# EAGLE design MotorDriver_Basic (EAGLE 9.3.2)
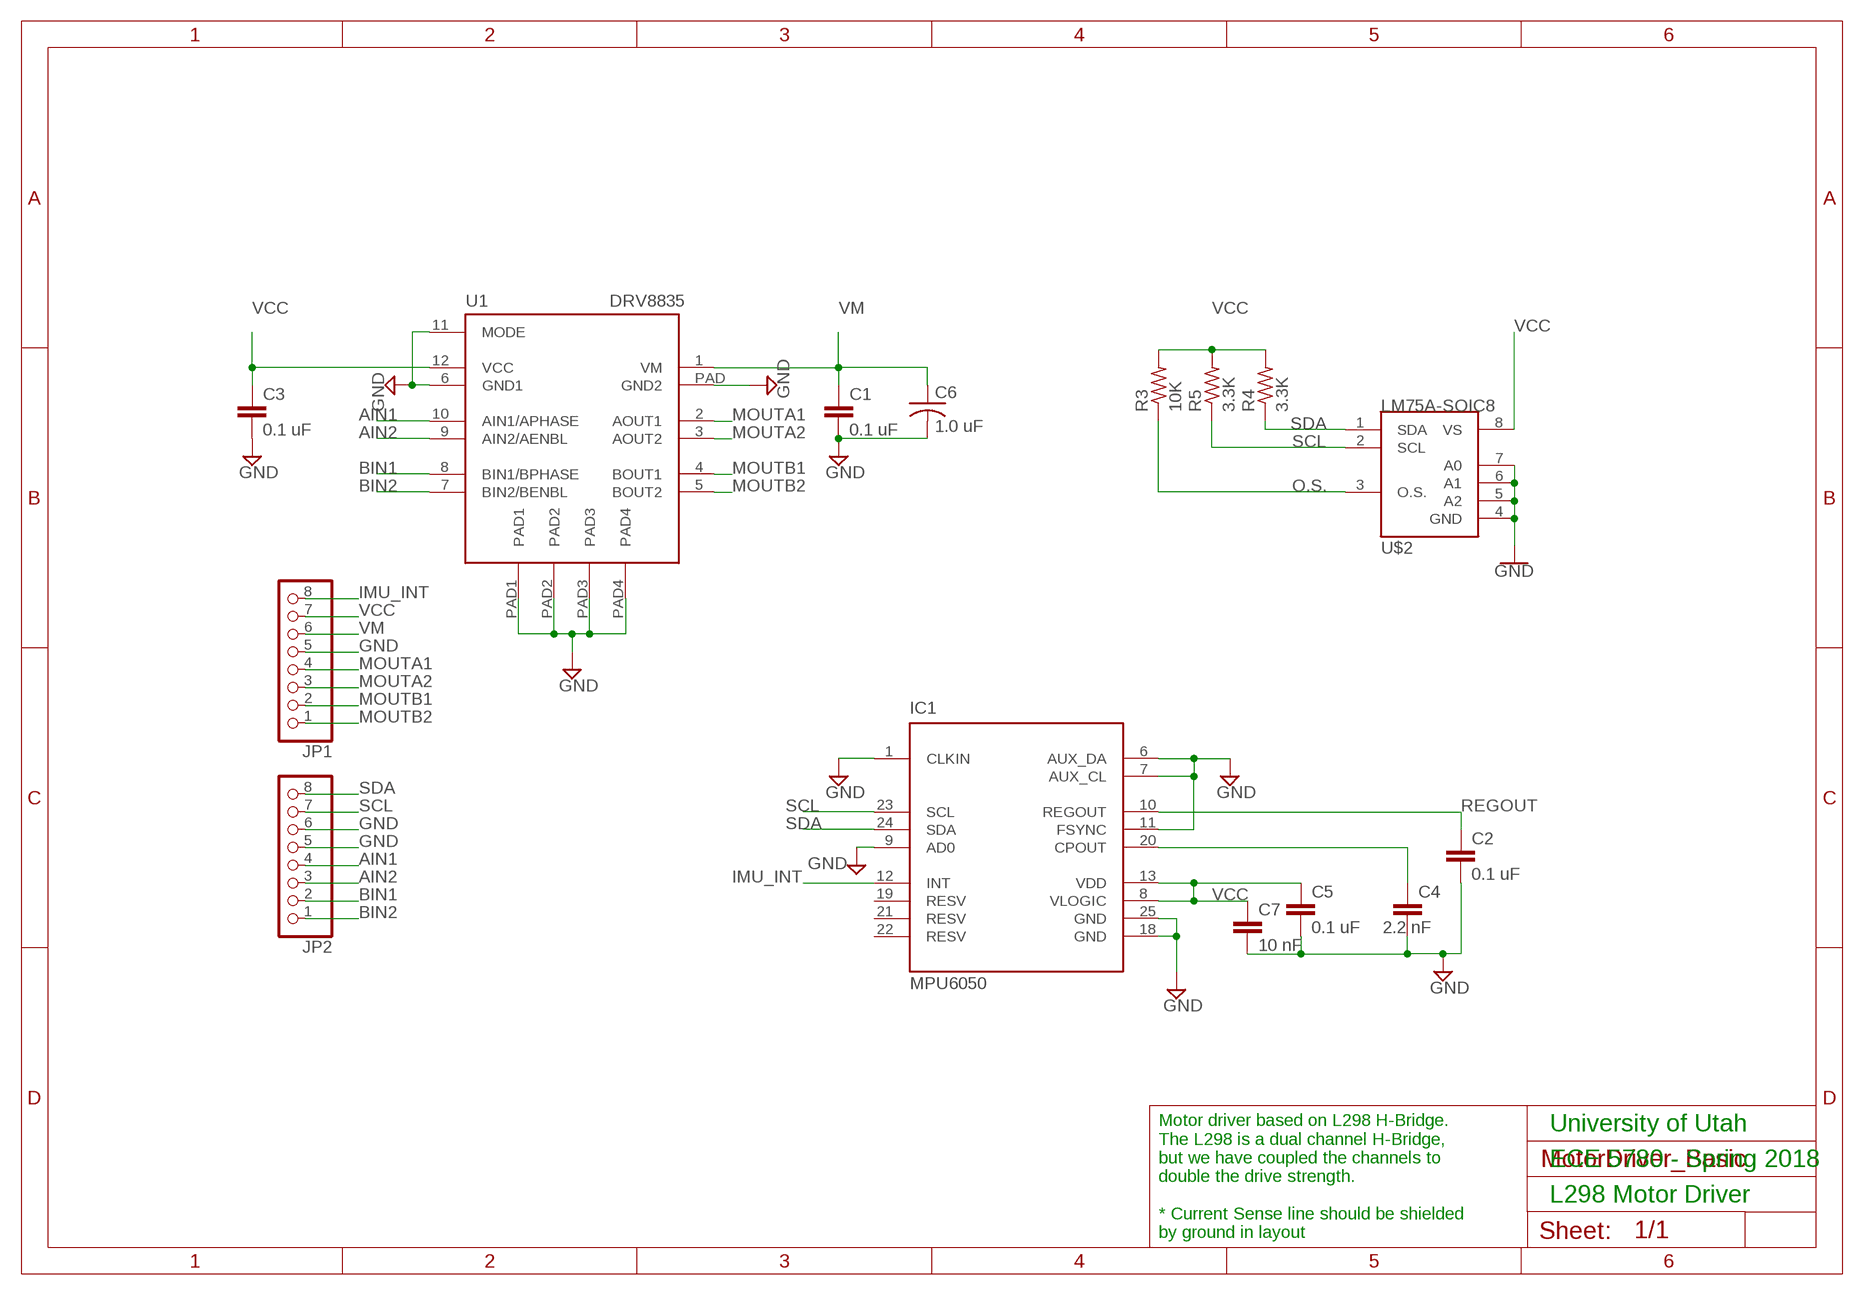
[diagram p0: schematic, sheet 1]

## Parts
C1  0.1 uF  C-EUC1206  [C1206]
C2  0.1 uF  C-EUC1206  [C1206]
C3  0.1 uF  C-EUC1206  [C1206]
C4  2.2 nF  C-EUC1206  [C1206]
C5  0.1 uF  C-EUC1206  [C1206]
C6  1.0 uF  C-US025-050X050  [C025-050X050]
C7  10 nF  C-EUC1206  [C1206]
IC1  MPU6050  [QFN50P400X400X95-25T265X275N]
JP1  PINHD-1X8  [1X08]
JP2  PINHD-1X8  [1X08]
R3  10K  R-US_M1206  [M1206]
R4  3.3K  R-US_M1206  [M1206]
R5  3.3K  R-US_M1206  [M1206]
U1  DRV8835  [WSON_2X3]
U$2  LM75A-SOIC8  [SOIC-8]

## Nets
AIN1: JP2.4 U1.10(AIN1/APHASE)
AIN2: JP2.3 U1.9(AIN2/AENBL)
BIN1: JP2.2 U1.8(BIN1/BPHASE)
BIN2: JP2.1 U1.7(BIN2/BENBL)
GND: C1.2 C2.2 C3.2 C4.2 C5.2 C6.2 C7.2 IC1.1(CLKIN) IC1.6(AUX_DA) IC1.7(AUX_CL) IC1.9(AD0) IC1.11(FSYNC) IC1.18(GND) IC1.25(GND) JP1.5 JP2.5 JP2.6 U1.6(GND1) U1.11(MODE) U1.PAD1 U1.PAD2 U1.PAD3 U1.PAD4 U1.PAD(GND2) U$2.4(GND) U$2.5(A2) U$2.6(A1) U$2.7(A0)
IMU_INT: IC1.12(INT) JP1.8
MOUTA1: JP1.4 U1.2(AOUT1)
MOUTA2: JP1.3 U1.3(AOUT2)
MOUTB1: JP1.2 U1.4(BOUT1)
MOUTB2: JP1.1 U1.5(BOUT2)
N$1: C4.1 IC1.20(CPOUT)
O.S.: R3.1 U$2.3(O.S.)
REGOUT: C2.1 IC1.10(REGOUT)
SCL: IC1.23(SCL) JP2.7 R5.1 U$2.2(SCL)
SDA: IC1.24(SDA) JP2.8 R4.1 U$2.1(SDA)
VCC: C3.1 C5.1 C7.1 IC1.8(VLOGIC) IC1.13(VDD) JP1.7 R3.2 R4.2 R5.2 U1.12(VCC) U$2.8(VS)
VM: C1.1 C6.1 JP1.6 U1.1(VM)
Unconnected: IC1.2(NC) IC1.3(NC) IC1.4(NC) IC1.5(NC) IC1.14(NC) IC1.15(NC) IC1.16(NC) IC1.17(NC) IC1.19(RESV) IC1.21(RESV) IC1.22(RESV)

## Notes on the sheet
- University of Utah
- ECE 5780 - Spring 2018
- L298 Motor Driver
- Motor driver based on L298 H-Bridge. 
  The L298 is a dual channel H-Bridge, 
  but we have coupled the channels to 
  double the drive strength. 
  
  * Current Sense line should be shielded 
  by ground in layout

## Library data of the parts
C1-C5 C7 = rcl:C-EU: CAPACITOR, European symbol; SPICEPREFIX: C
C6 = rcl:C-US: CAPACITOR, American symbol; SPICEPREFIX: C
IC1 = invensense:MPU6050: The triple-axis MEMS gyroscope
JP1 JP2 = pinhead:PINHD-1X8: PIN HEADER
R3-R5 = rcl:R-US_: RESISTOR, American symbol; SPICEPREFIX: R
U1 = bt_motordriver:DRV8835: DRV8835 DUAL LOW VOLTAGE H-BRIDGE IC The DRV8835 provides an integrated motor driver solution for cameras, consumer products, toys, and other low voltage or battery-powered motion control applications. The device has two H-bridge drivers, and can drive two DC motors or one stepper motor, as well as other devices like solenoids. The device has two H-bridge drivers, and drives two DC motors or one stepper motor, as well as other devices like solenoids. The output driver block for each consists of N-channel power MOSFETs configured as an H-bridge to drive the motor winding. An internal charge pump generates gate drive voltages. 1.5-A Maximum Drive Current Per H-Bridge Configure Bridges Parallel for 3-A Drive Curren 0-V to 11-V Motor-Operating Supply-Voltage 2-V to 7-V Logic Supply-Voltage Flexible PWM or PHASE/ENABLE Interface Low-Power Sleep Mode With 95-nA Maximum Supply Current Tiny 2.00-mm × 3.00-mm WSON Package Reference: http://www.ti.com/lit/ds/symlink/drv8835.pdf
U$2 = L298_Motor_Driver_Lib_ECE5780:LM75A-SOIC8

## Board
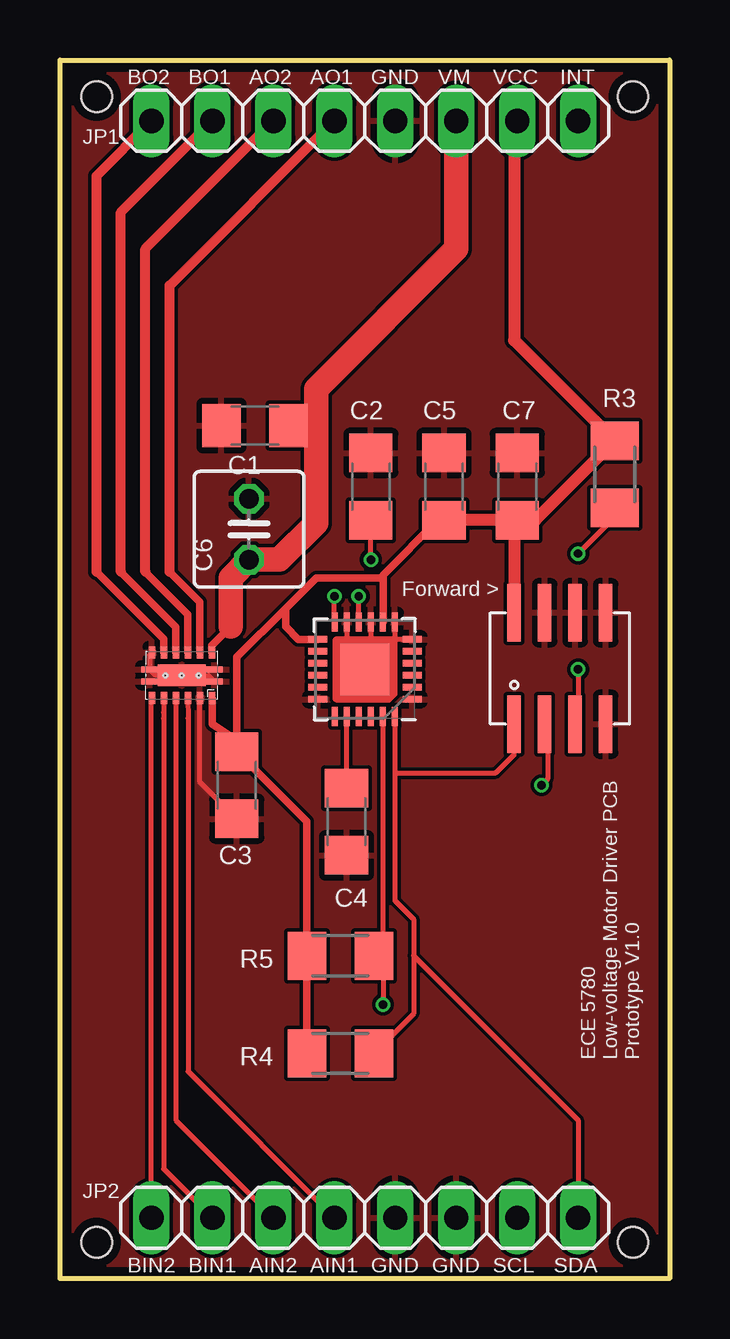
[diagram p1: board, top side]
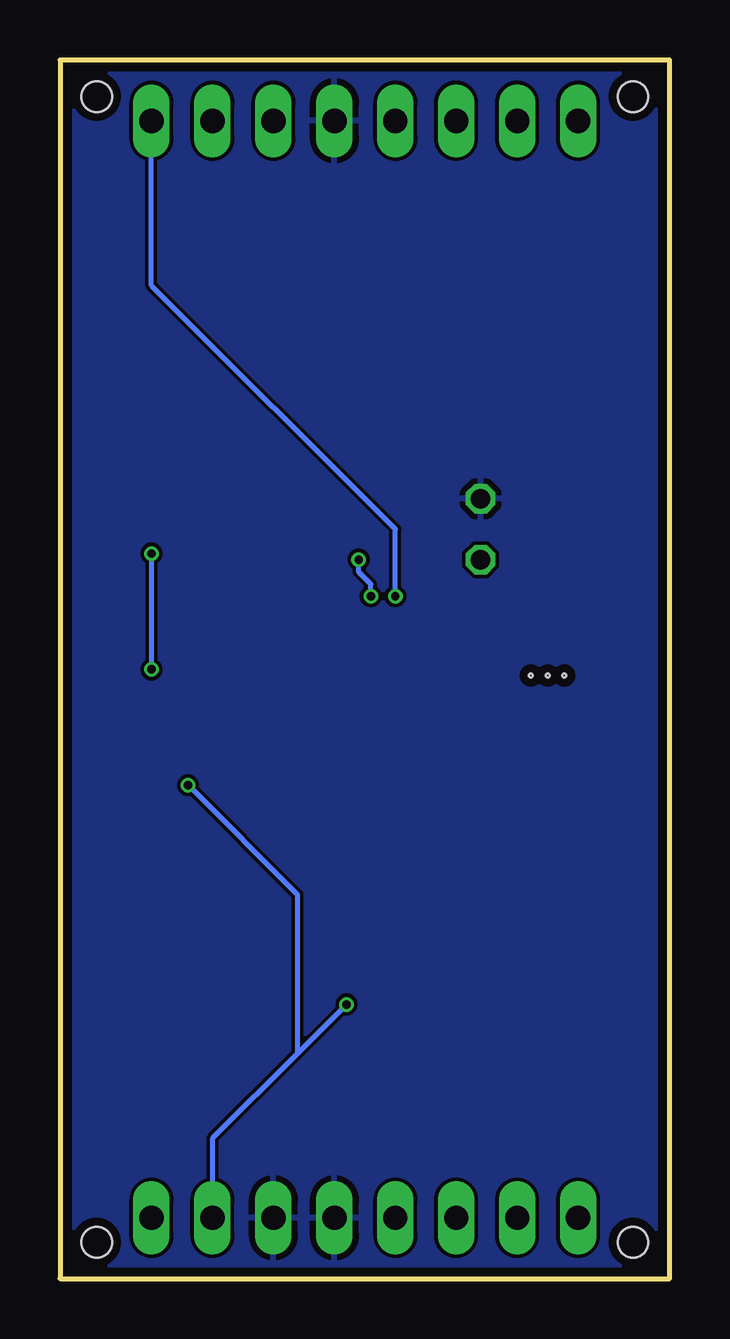
[diagram p2: board, bottom side, seen from below]

Size 25.4 x 50.8 mm. Coordinates in mm from the lower left corner, seen from the top.
Outline: 0,0 0,50.8 25.4,50.8 25.4,0 0,0
Copper layers (1*16): Top 0.035559375mm / dielectric 1.6mm / Bottom 0.035559375mm
Design rules "2layer": minimum track width 6mil, minimum drill 10mil, track to track 6mil, track to pad 6mil, pad to pad 6mil, via to via 6mil, smd to smd 6mil, copper to edge 15mil, drill to drill 6mil, minimum pad ring 5mil, minimum via ring 5mil, stop-mask expansion 2.5mil, vias tented up to drill 0mil, thermal gap 10mil
Holes 1.27 mm at 23.88,49.28 1.52,49.28 23.88,1.52 1.52,1.52

### Footprints (pad centres in the part's own frame; a part is rotated, then mirrored left to right if it is on the bottom)
C1206 = smd 1.6 x 1.8: 1 -1.4,0; 2 1.4,0
C025-050X050 = drill 0.813 octagon: 1 -1.27,0; 2 1.27,0
QFN50P400X400X95-25T265X275N = smd 0.26 x 0.79: 1 -1.25,-1.97; 2 -0.75,-1.97; 3 -0.25,-1.97; 4 0.25,-1.97; 5 0.75,-1.97; 6 1.25,-1.97; 13 1.25,1.97; 14 0.75,1.97; 15 0.25,1.97; 16 -0.25,1.97; 17 -0.75,1.97; 18 -1.25,1.97 | smd 0.79 x 0.26: 7 1.97,-1.25; 8 1.97,-0.75; 9 1.97,-0.25; 10 1.97,0.25; 11 1.97,0.75; 12 1.97,1.25; 19 -1.97,1.25; 20 -1.97,0.75; 21 -1.97,0.25; 22 -1.97,-0.25; 23 -1.97,-0.75; 24 -1.97,-1.25 | smd 2.15 x 2.05: 25 0,0
1X08 = drill 1.016 long: 1 -8.89,0; 2 -6.35,0; 3 -3.81,0; 4 -1.27,0; 5 1.27,0; 6 3.81,0; 7 6.35,0; 8 8.89,0
M1206 = smd 1.6 x 2: 1 -1.4,0; 2 1.4,0
WSON_2X3 = smd 0.28 x 0.5: 1 -1.25,-0.95; 2 -0.75,-0.95; 3 -0.25,-0.95; 4 0.25,-0.95; 5 0.75,-0.95; 6 1.25,-0.95; 7 1.25,0.95; 8 0.75,0.95; 9 0.25,0.95; 10 -0.25,0.95; 11 -0.75,0.95; 12 -1.25,0.95 | smd 2 x 0.9: PAD 0,0 | smd 0.7 x 0.25: PAD1 -1.35,0.25; PAD2 -1.35,-0.25; PAD3 1.35,-0.25; PAD4 1.35,0.25 | hole 0.15: 0,0; -0.7,0; 0.7,0
SOIC-8 = smd 2.388 x 0.559: 1 -2.54,1.905; 2 -2.54,0.635; 3 -2.54,-0.635; 4 -2.54,-1.905; 5 2.108,-1.905; 6 2.108,-0.635; 7 2.108,0.635; 8 2.108,1.905

### Placement (x,y rotation side)
C1  8.13,35.56 180 top
C2  12.95,33.02 90 top
C3  7.37,20.57 270 top
C4  11.94,19.05 270 top
C5  16,33.02 90 top
C6  7.87,31.24 90 top
C7  19.05,33.02 90 top
IC1  12.7,25.4 90 top
JP1  12.7,48.26 0 top
JP2  12.7,2.54 0 top
R3  23.11,33.53 90 top
R4  11.68,9.4 180 top
R5  11.68,13.46 180 top
U1  5.08,25.15 180 top
U$2  20.83,25.65 90 top

### Tracks (layer width: path | path; a pad name or v marks a point on that pad's centre or on a via)
AIN1
  Top 0.203: U1.10 5.33,23.37 5.33,8.64 JP2.4
AIN2
  Top 0.203: U1.9 4.83,23.37 4.83,6.6 JP2.3
BIN1
  Top 0.203: U1.8 4.32,23.62 4.32,23.37 4.32,4.57 JP2.2
BIN2
  Top 0.203: U1.7 3.81,24.18 JP2.1
GND
  Top 0.203: IC1.9 12.95,26.42 | 12.95,26.42 12.95,25.91 12.7,25.66 IC1.25 12.7,25.91 11.94,26.67 11.94,27.36 IC1.11 | IC1.6 13.95,26.65 IC1.7 13.95,26.73 13.63,26.42 12.95,26.42 | U1.6 3.73,26 U1.PAD3 3.98,25.15 U1.PAD 6.18,25.15 U1.PAD1 | U1.11 5.83,20.71 C3.2
  pour Top: 0,0 0,50.8 25.4,50.8 25.4,0
  pour Bottom: 0,0 0,50.8 25.4,50.8 25.4,0
IMU_INT  (via drill 0.35)
  Top 0.203: IC1.12 11.43,27.39 v11.43,28.45
  Bottom 0.203: v11.43,28.45 11.43,31.24 21.59,41.4 JP1.8
MOUTA1
  Top 0.305: U1.2 5.83,28.21 4.57,29.46
  Top 0.406: 4.57,29.46 4.57,41.4 JP1.4
MOUTA2
  Top 0.305: U1.3 5.33,27.69 3.56,29.46
  Top 0.406: 3.56,29.46 3.56,42.93 JP1.3
MOUTB1
  Top 0.305: U1.4 4.83,27.17 2.54,29.46
  Top 0.406: 2.54,29.46 2.54,44.45 JP1.2
MOUTB2
  Top 0.305: U1.5 4.33,26.66 1.52,29.46
  Top 0.406: 1.52,29.46 1.52,45.97 JP1.1
N$1
  Top 0.203: C4.1 11.95,20.46 IC1.20
O.S.  (via drill 0.35)
  Top 0.203: R3.1 23.11,31.75 v21.59,30.23 | v21.59,25.4 21.59,23.24 U$2.3
  Bottom 0.203: v21.59,30.23 v21.59,25.4
REGOUT  (via drill 0.35)
  Top 0.203: IC1.10 v12.45,28.45 | v12.95,29.97 C2.1
  Bottom 0.203: v12.45,28.45 12.45,28.96 12.95,29.46 v12.95,29.97
SCL  (via drill 0.35 pad 0.55)
  Top 0.203: IC1.23 13.45,13.83 R5.1 13.46,13.08 v13.46,11.43 | v20.07,20.57 20.32,20.83 20.32,22.99 U$2.2
  Bottom 0.203: v13.46,11.43 15.49,9.4 | 15.49,9.4 19.05,5.84 JP2.7 | 15.49,9.4 15.49,16 v20.07,20.57
SDA
  Top 0.203: IC1.24 13.95,21.08 | 13.95,21.08 13.95,15.77 14.73,14.99 14.73,13.46 | 14.73,13.46 14.73,11.05 R4.1 | 14.73,13.46 21.59,6.6 JP2.8 | 13.95,21.08 18.16,21.08 18.92,21.84 U$2.1
VCC
  Top 0.152: 6.35,24.18 U1.12
  Top 0.203: IC1.8 13.46,27.38 | C7.1 18.92,31.49
  Top 0.305: C5.1 15.75,31.62 13.46,29.33 13.46,29.21 | 13.46,27.38 13.46,29.21 | 13.46,29.21 10.67,29.21 9.4,27.94 | 9.4,27.94 9.4,27.18 9.93,26.65 IC1.13 | 9.4,27.94 7.37,25.91 7.37,22.44 | 7.37,21.84 7.37,22.44 | 7.37,22.44 6.35,23.11 6.35,24.18 | C3.1 10.28,19.06 R5.2 R4.2
  Top 0.508: C5.1 C7.1 19.81,31.62 R3.2 18.92,39.12 18.92,48.13 JP1.7 | 18.92,31.49 U$2.8 | C3.1 7.37,21.84
VM
  Top 0.305: 7.11,27.18 6.33,26.4 U1.1
  Top 1.016: JP1.6 16.51,42.93 10.67,37.08 10.67,35.56 | 10.67,35.56 10.67,31.5 9.14,29.97 C6.1 7.11,29.21 7.11,27.18 | 10.67,35.56 C1.1

### Text on the board
tPlace: BO2 | BO1 | AO2 | AO1 | GND | VM | VCC | INT | Forward > | ECE 5780 / Low-voltage Motor Driver PCB / Prototype V1.0 | BIN2 | BIN1 | AIN2 | AIN1 | GND | GND | SCL | SDA